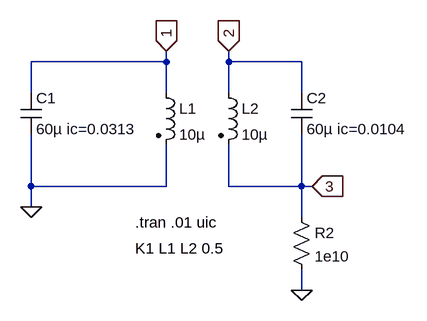
[diagram p0: schematic electrical analoge double pendulum.asc]
electrical analoge double pendulum.asc, the LTspice schematic file:
Version 4
SHEET 1 880 680
WIRE 144 64 144 48
WIRE 144 64 -64 64
WIRE 240 64 240 48
WIRE 352 64 240 64
WIRE -64 112 -64 64
WIRE 144 112 144 64
WIRE 240 112 240 64
WIRE 352 112 352 64
WIRE -64 256 -64 176
WIRE 144 256 144 192
WIRE 144 256 -64 256
WIRE 240 256 240 192
WIRE 352 256 352 176
WIRE 352 256 240 256
WIRE 368 256 352 256
WIRE -64 288 -64 256
WIRE 352 304 352 256
WIRE 352 416 352 384
FLAG -64 288 0
FLAG 352 416 0
FLAG 144 48 1
IOPIN 144 48 In
FLAG 240 48 2
IOPIN 240 48 In
FLAG 368 256 3
IOPIN 368 256 In
SYMBOL ind2 128 96 R0
SYMATTR InstName L1
SYMATTR Value 10µ
SYMATTR Type ind
SYMATTR SpiceLine Rser=0.0001
SYMBOL ind2 224 96 R0
SYMATTR InstName L2
SYMATTR Value 10µ
SYMATTR Type ind
SYMATTR SpiceLine Rser=0.001
SYMBOL cap -80 112 R0
SYMATTR InstName C1
SYMATTR Value 60µ ic=0.0313
SYMBOL cap 336 112 R0
SYMATTR InstName C2
SYMATTR Value 60µ ic=0.0104
SYMBOL res 336 288 R0
SYMATTR InstName R2
SYMATTR Value 1e10
TEXT 96 352 Left 2 !K1 L1 L2 0.5
TEXT 96 312 Left 2 !.tran .01 uic

The netlist it stands for:
* electrical analoge double pendulum.asc
L1 1 0 10µ Rser=0.0001
L2 2 3 10µ Rser=0.001
C1 1 0 60µ ic=0.0313
C2 2 3 60µ ic=0.0104
R2 3 0 1e10
K1 L1 L2 0.5
.tran .01 uic
.backanno
.end